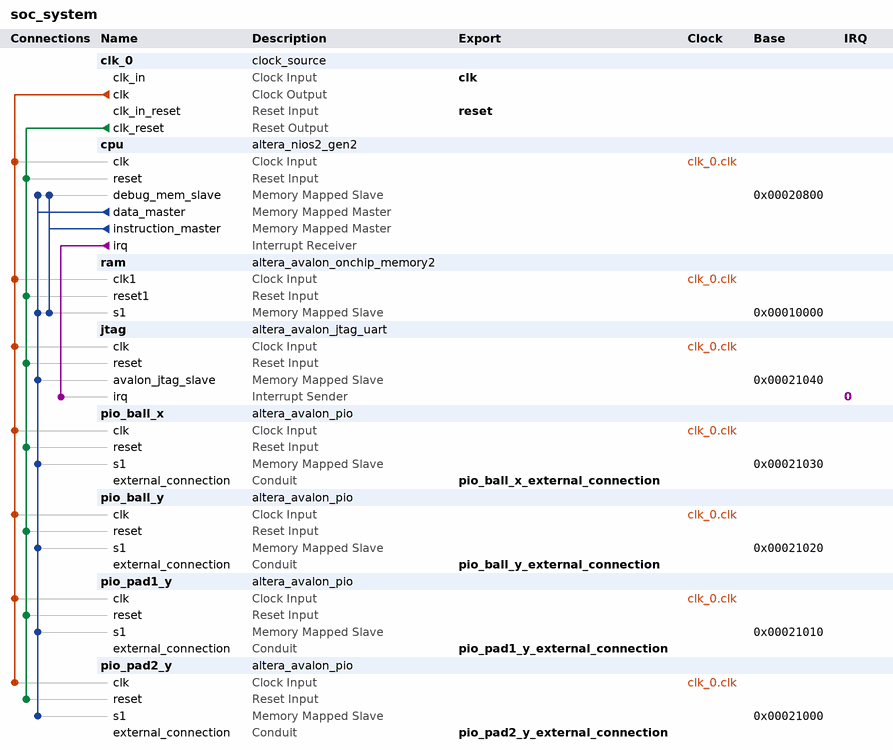
[diagram p0: system contents]
# Platform Designer (Qsys) system soc_system, Cyclone 10 LP 10CL025YU256I7G
# Parameters at their usual value, and those the tool derives, are not listed.
package require -exact qsys 20.1
create_system soc_system
set_project_property DEVICE_FAMILY {Cyclone 10 LP}
set_project_property DEVICE 10CL025YU256I7G

add_instance clk_0 clock_source 20.1
set_instance_parameter_value clk_0 clockFrequency 50000000

add_instance cpu altera_nios2_gen2 20.1
set_instance_parameter_value cpu dcache_size 2048
set_instance_parameter_value cpu exceptionSlave ram.s1
set_instance_parameter_value cpu icache_size 4096
set_instance_parameter_value cpu impl Tiny
set_instance_parameter_value cpu resetSlave ram.s1

add_instance ram altera_avalon_onchip_memory2 20.1
set_instance_parameter_value ram dataWidth 32
set_instance_parameter_value ram dualPort false
set_instance_parameter_value ram initMemContent true
set_instance_parameter_value ram initializationFileName onchip_mem.hex
set_instance_parameter_value ram memorySize 32768

add_instance jtag altera_avalon_jtag_uart 20.1
set_instance_parameter_value jtag simInteractiveOptions NO_INTERACTIVE_WINDOWS

add_instance pio_ball_x altera_avalon_pio 20.1
set_instance_parameter_value pio_ball_x direction Output
set_instance_parameter_value pio_ball_x width 10

add_instance pio_ball_y altera_avalon_pio 20.1
set_instance_parameter_value pio_ball_y direction Output
set_instance_parameter_value pio_ball_y width 10

add_instance pio_pad1_y altera_avalon_pio 20.1
set_instance_parameter_value pio_pad1_y direction Output
set_instance_parameter_value pio_pad1_y width 10

add_instance pio_pad2_y altera_avalon_pio 20.1
set_instance_parameter_value pio_pad2_y direction Output
set_instance_parameter_value pio_pad2_y width 10

# connections
add_connection clk_0.clk cpu.clk clock
add_connection clk_0.clk jtag.clk clock
add_connection clk_0.clk pio_ball_x.clk clock
add_connection clk_0.clk pio_ball_y.clk clock
add_connection clk_0.clk pio_pad1_y.clk clock
add_connection clk_0.clk pio_pad2_y.clk clock
add_connection clk_0.clk ram.clk1 clock
add_connection clk_0.clk_reset cpu.reset reset
add_connection clk_0.clk_reset jtag.reset reset
add_connection clk_0.clk_reset pio_ball_x.reset reset
add_connection clk_0.clk_reset pio_ball_y.reset reset
add_connection clk_0.clk_reset pio_pad1_y.reset reset
add_connection clk_0.clk_reset pio_pad2_y.reset reset
add_connection clk_0.clk_reset ram.reset1 reset
add_connection cpu.data_master cpu.debug_mem_slave avalon
set_connection_parameter_value cpu.data_master/cpu.debug_mem_slave baseAddress 0x00020800
add_connection cpu.data_master jtag.avalon_jtag_slave avalon
set_connection_parameter_value cpu.data_master/jtag.avalon_jtag_slave baseAddress 0x00021040
add_connection cpu.data_master pio_ball_x.s1 avalon
set_connection_parameter_value cpu.data_master/pio_ball_x.s1 baseAddress 0x00021030
add_connection cpu.data_master pio_ball_y.s1 avalon
set_connection_parameter_value cpu.data_master/pio_ball_y.s1 baseAddress 0x00021020
add_connection cpu.data_master pio_pad1_y.s1 avalon
set_connection_parameter_value cpu.data_master/pio_pad1_y.s1 baseAddress 0x00021010
add_connection cpu.data_master pio_pad2_y.s1 avalon
set_connection_parameter_value cpu.data_master/pio_pad2_y.s1 baseAddress 0x00021000
add_connection cpu.data_master ram.s1 avalon
set_connection_parameter_value cpu.data_master/ram.s1 baseAddress 0x00010000
add_connection cpu.instruction_master cpu.debug_mem_slave avalon
set_connection_parameter_value cpu.instruction_master/cpu.debug_mem_slave baseAddress 0x00020800
add_connection cpu.instruction_master ram.s1 avalon
set_connection_parameter_value cpu.instruction_master/ram.s1 baseAddress 0x00010000
add_connection cpu.irq jtag.irq interrupt
set_connection_parameter_value cpu.irq/jtag.irq irqNumber 0

# exported interfaces
add_interface clk clock sink
set_interface_property clk EXPORT_OF clk_0.clk_in
add_interface pio_ball_x_external_connection conduit end
set_interface_property pio_ball_x_external_connection EXPORT_OF pio_ball_x.external_connection
add_interface pio_ball_y_external_connection conduit end
set_interface_property pio_ball_y_external_connection EXPORT_OF pio_ball_y.external_connection
add_interface pio_pad1_y_external_connection conduit end
set_interface_property pio_pad1_y_external_connection EXPORT_OF pio_pad1_y.external_connection
add_interface pio_pad2_y_external_connection conduit end
set_interface_property pio_pad2_y_external_connection EXPORT_OF pio_pad2_y.external_connection
add_interface reset reset sink
set_interface_property reset EXPORT_OF clk_0.clk_in_reset

set_interconnect_requirement {$system} qsys_mm.clockCrossingAdapter HANDSHAKE
set_interconnect_requirement {$system} qsys_mm.enableEccProtection FALSE
set_interconnect_requirement {$system} qsys_mm.insertDefaultSlave FALSE
set_interconnect_requirement {$system} qsys_mm.maxAdditionalLatency 1

save_system soc_system.qsys
